# EAGLE schematic MotorBoard (EAGLE 6.6.0)
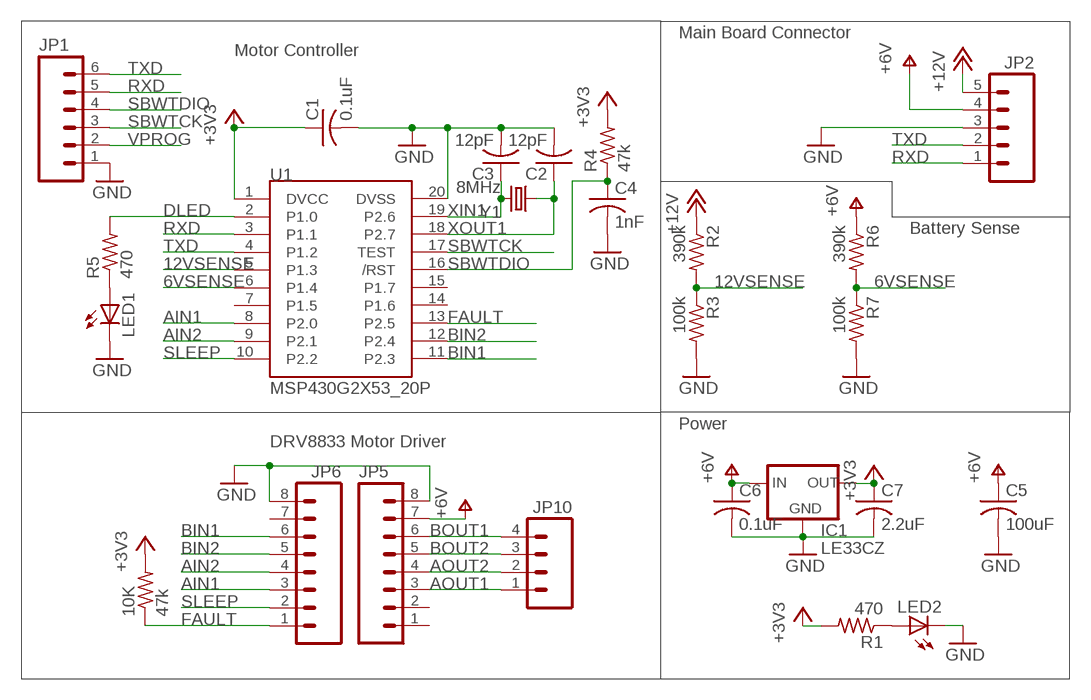
[diagram p0: schematic, sheet 1]

## Parts
10K  47k  R-US_R0805  [R0805]
C1  0.1uF  C-USC0805  [C0805]
C2  12pF  C-USC0805  [C0805]
C3  12pF  C-USC0805  [C0805]
C4  1nF  C-USC0805  [C0805]
C5  100uF  C-USC0805  [C0805]
C6  0.1uF  C-USC0805  [C0805]
C7  2.2uF  C-USC0805  [C0805]
IC1  LE33CZ  V_REG_78XXTO-92  [TO-92]
JP1  M06SIP  [1X06]
JP2  M05PTH  [1X05]
JP5  M081X08  [1X08]
JP6  M081X08  [1X08]
JP10  M04PTH  [1X04]
LED1  LEDCHIP-LED0805  [CHIP-LED0805]
LED2  LEDCHIP-LED0805  [CHIP-LED0805]
R1  470  R-US_R0805  [R0805]
R2  390k  R-US_R0805  [R0805]
R3  100k  R-US_R0805  [R0805]
R4  47k  R-US_R0805  [R0805]
R5  470  R-US_R0805  [R0805]
R6  390k  R-US_R0805  [R0805]
R7  100k  R-US_R0805  [R0805]
U1  MSP430G2X53_20P  [TSSOP20_PW]
Y1  8MHz  CRYSTALHC49UV  [HC49U-V]

## Nets
6VSENSE: R6.2 R7.1 U1.6(P1.4)
12VSENSE: R2.2 R3.1 U1.5(P1.3)
+3V3: 10K.2 C1.1 C7.1 IC1.3(OUT) R1.2 R4.2 U1.1(DVCC)
+12V: JP2.5 R2.1
AIN1: JP6.3 U1.8(P2.0)
AIN2: JP6.4 U1.9(P2.1)
AOUT1: JP5.3 JP10.1
AOUT2: JP5.4 JP10.2
BIN1: JP6.6 U1.11(P2.3)
BIN2: JP6.5 U1.12(P2.4)
BOUT1: JP5.6 JP10.4
BOUT2: JP5.5 JP10.3
DLED: R5.2 U1.2(P1.0)
FAULT: 10K.1 JP6.1 U1.13(P2.5)
GND: C1.2 C2.2 C3.2 C4.2 C5.2 C6.2 C7.2 IC1.1(GND) JP1.1 JP2.3 JP5.8 JP6.8 LED1.C LED2.C R3.2 R7.2 U1.20(DVSS)
N$1: LED1.A R5.1
N$5: LED2.A R1.1
RXD: JP1.5 JP2.1 U1.3(P1.1)
SBWTCK: JP1.3 U1.17(TEST)
SBWTDIO: C4.1 JP1.4 R4.1 U1.16(/RST)
SLEEP: JP6.2 U1.10(P2.2)
TXD: JP1.6 JP2.2 U1.4(P1.2)
V+: C5.1 C6.1 IC1.2(IN) JP2.4 JP5.7 R6.1 ; supply symbol labelled +6V
VPROG: JP1.2
XIN1: C3.1 U1.19(P2.6) Y1.2
XOUT1: C2.1 U1.18(P2.7) Y1.1
Unconnected: JP5.1 JP5.2 JP6.7 U1.7(P1.5) U1.14(P1.6) U1.15(P1.7)

## Notes on the sheet
- Main Board Connector
- Motor Controller
- Battery Sense
- Power
- DRV8833 Motor Driver

## Library data of the parts
10K R1-R7 = rcl:R-US_: RESISTOR, American symbol
C1-C7 = rcl:C-US: CAPACITOR, American symbol
IC1 = SparkFun-PowerIC:V_REG_78XX: Voltage Regulator Standard 7805 5V regulator. IGO (Input Ground Output). Spark Fun Electronics SKU : COM-00107
JP1 = SparkFun-Connectors:M06: Header 6 Standard 6-pin 0.1" header. Use with straight break away headers (SKU : PRT-00116), right angle break away headers (PRT-00553), swiss pins (PRT-00743), machine pins (PRT-00117), and female headers (PRT-00115). Molex polarized connector foot print use with SKU : PRT-08094 with associated crimp pins and housings. NOTES ON THE VARIANTS LOCK and LOCK_LONGPADS... This footprint was designed to help hold the alignment of a through-hole component (i.e. 6-pin header) while soldering it into place. You may notice that each hole has been shifted either up or down by 0.005 of an inch from it's more standard position (which is a perfectly straight line). This slight alteration caused the pins (the squares in the middle) to touch the edges of the holes. Because they are alternating, it causes a "brace" to hold the component in place. 0.005 has proven to be the perfect amount of "off-center" position when using our standard breakaway headers. Although looks a little odd when you look at the bare footprint, once you have a header in there, the alteration is very hard to notice. Also,if you push a header all the way into place, it is covered up entirely on the bottom side. This idea of altering the position of holes to aid alignment will be further integrated into the Sparkfun Library for other footprints. It can help hold any component with 3 or more connection pins.
JP2 = SparkFun-Connectors:M05: Header 5 Standard 5-pin 0.1" header. Use with straight break away headers (SKU : PRT-00116), right angle break away headers (PRT-00553), swiss pins (PRT-00743), machine pins (PRT-00117), and female headers (PRT-00115). Molex polarized connector foot print use with SKU : PRT-08230 with associated crimp pins and housings.
JP5 JP6 = SparkFun-Connectors:M08: Header 8 Standard 8-pin 0.1" header. Use with straight break away headers (SKU : PRT-00116), right angle break away headers (PRT-00553), swiss pins (PRT-00743), machine pins (PRT-00117), and female headers (PRT-00115).
JP10 = SparkFun-Connectors:M04: Header 4 Standard 4-pin 0.1" header. Use with straight break away headers (SKU : PRT-00116), right angle break away headers (PRT-00553), swiss pins (PRT-00743), machine pins (PRT-00117), and female headers (PRT-00115). Molex polarized connector foot print use with SKU : PRT-08231 with associated crimp pins and housings. 1MM SMD Version SKU: PRT-10208
LED1 LED2 = led:LED: LED OSRAM: - CHIPLED LG R971, LG N971, LY N971, LG Q971, LY Q971, LO R971, LY R971 LH N974, LH R974 LS Q976, LO Q976, LY Q976 LO Q996 - Hyper CHIPLED LW Q18S LB Q993, LB Q99A, LB R99A - SideLED LS A670, LO A670, LY A670, LG A670, LP A670 LB A673, LV A673, LT A673, LW A673 LH A674 LY A675 LS A676, LA A676, LO A676, LY A676, LW A676 LS A679, LY A679, LG A679 - Hyper Micro SIDELED® LS Y876, LA Y876, LO Y876, LY Y876 LT Y87S - SmartLED LW L88C, LW L88S LB L89C, LB L89S, LG L890 LS L89K, LO L89K, LY L89K LS L896, LA L896, LO L896, LY L896 - TOPLED LS T670, LO T670, LY T670, LG T670, LP T670 LSG T670, LSP T670, LSY T670, LOP T670, LYG T670 LG T671, LOG T671, LSG T671 LB T673, LV T673, LT T673, LW T673 LH T674 LS T676, LA T676, LO T676, LY T676, LB T676, LH T676, LSB T676, LW T676 LB T67C, LV T67C, LT T67C, LS T67K, LO T67K, LY T67K, LW E67C LS E67B, LA E67B, LO E67B, LY E67B, LB E67C, LV E67C, LT E67C LW T67C LS T679, LY T679, LG T679 LS T770, LO T770, LY T770, LG T770, LP T770 LB T773, LV T773, LT T773, LW T773 LH T774 LS E675, LA E675, LY E675, LS T675 LS T776, LA T776, LO T776, LY T776, LB T776 LHGB T686 LT T68C, LB T68C - Hyper Mini TOPLED® LB M676 - Mini TOPLED Santana® LG M470 LS M47K, LO M47K, LY M47K Source: http://www.osram.convergy.de LUXEON: - LUMILED® LXK2-PW12-R00, LXK2-PW12-S00, LXK2-PW14-U00, LXK2-PW14-V00 LXK2-PM12-R00, LXK2-PM12-S00, LXK2-PM14-U00 LXK2-PE12-Q00, LXK2-PE12-R00, LXK2-PE12-S00, LXK2-PE14-T00, LXK2-PE14-U00 LXK2-PB12-K00, LXK2-PB12-L00, LXK2-PB12-M00, LXK2-PB14-N00, LXK2-PB14-P00, LXK2-PB14-Q00 LXK2-PR12-L00, LXK2-PR12-M00, LXK2-PR14-Q00, LXK2-PR14-R00 LXK2-PD12-Q00, LXK2-PD12-R00, LXK2-PD12-S00 LXK2-PH12-R00, LXK2-PH12-S00 LXK2-PL12-P00, LXK2-PL12-Q00, LXK2-PL12-R00 Source: www.luxeon.com KINGBRIGHT: KA-3528ASYC Source: www.kingbright.com
U1 = npol:MSP430G2X53_20P: MSP430G2x53 16-bit Microcontroller, 20pin devices
Y1 = SparkFun-FreqCtrl:CRYSTAL: Various standard crystals. Proven footprints. Spark Fun Electronics SKU : COM-00534